# Altium schematic sheet [2]Battery.SchDoc
size B
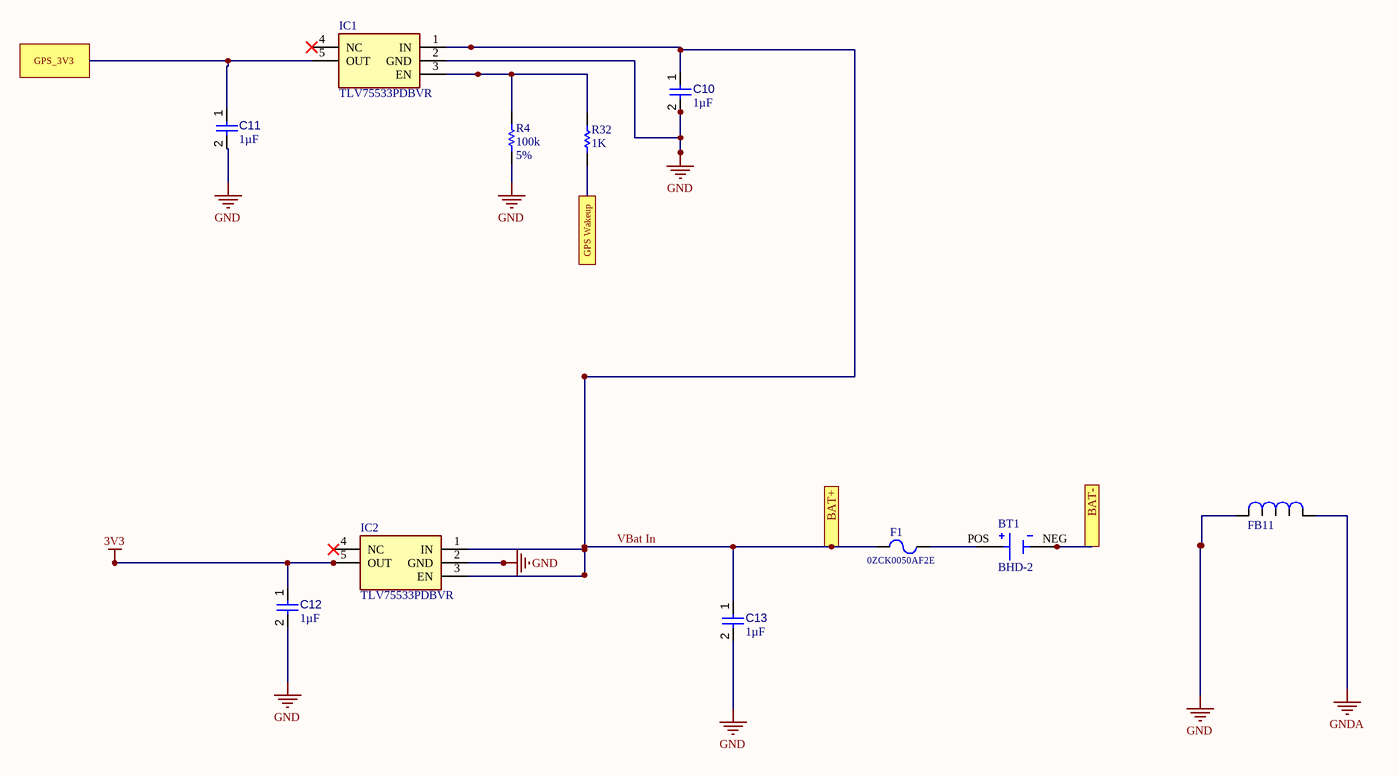
[diagram p0: [2]Battery.SchDoc]

## Parts
BT1  BHD-2  [BAT_BHD-2]
C10  value 1µF  [CAPC1608X90X40ML10T20]  (hidden comment: Capacitor 1 uF +/- 10% 25 V 0603)
C11  value 1µF  [CAPC1608X90X40ML10T20]  (hidden comment: Capacitor 1 uF +/- 10% 25 V 0603)
C12  value 1µF  [CAPC1608X90X40ML10T20]  (hidden comment: Capacitor 1 uF +/- 10% 25 V 0603)
C13  value 1µF  [CAPC1608X90X40ML10T20]  (hidden comment: Capacitor 1 uF +/- 10% 25 V 0603)
F1  MF PN: 0ZCK0050AF2E  [PTC RESET FUSE 9V 500MA 0805]  (hidden comment: PTC 9V 500mA)
FB11  BLM18AG102SN1D  [Ferrite Bead]  (value not drawn)
IC1  TLV75533PDBVR  [SOT95P280X145-5N]
IC2  TLV75533PDBVR  [SOT95P280X145-5N]
R4  value 100k  Tolerance: 5%  [RES 0603]  (hidden comment: RES 100K 5% 0.1W [0603])
R32  1K  [RES 0603]

## Ports
BAT+, BAT-, GPS Wakeup, GPS_3V3

## Nets
3V3: C12.1 IC2.5(OUT)
GND: C10.2 C11.2 C12.2 C13.2 FB11.2 IC1.2(GND) IC2.2(GND) R4.1
GNDA: FB11.1
BAT-: BT1.NEG ; port BAT-
GPS Wakeup: R32.2 ; port GPS Wakeup
GPS_3V3: C11.1 IC1.5(OUT) ; port GPS_3V3
VBat In: C10.1 C13.1 F1.1 IC1.1(IN) IC2.1(IN) IC2.3(EN) ; port BAT+
NetBT1_POS: BT1.POS F1.2
NetIC1_3: IC1.3(EN) R4.2 R32.1

Not connected (* = marked no-connect by the designer): IC1 4(NC)*; IC2 4(NC)*

## Notes on the sheet
- Title
- Size:
- Date:
- A3
- Number:
- Time:
- Revision:
- Sheet
- of
- File:

## Library data of the parts
BT1 = BHD-2: BATTERY HOLDER D PC PIN; MF: MPD; Value: *; Package: None; MP: BHD-2; Price: None; Availability: Bad; SnapEDA_Link: https://www.snapeda.com/parts/BHD-2/Memory%20Protection%20Devices/view-part/4219639/?ref=snap; BuyPart: https://www.snapeda.com/parts/BHD-2/Memory%20Protection%20Devices/view-part/4219639/?ref=eda
C10-C13 = CMP-001-00005-4: Chip Capacitor, 1 uF, +/- 10%, 25 V, 0603 (1608 Metric); Voltage Rating: 25V; Capacitor Type: Ceramic; Min Operating Temperature: -55°C; Tolerance: 10%; Max Operating Temperature: 125°C; Case/Package: 0603; RoHS Compliant: True; Mounting Technology: SM; Pins: 2
F1 = PTC RESET FUSE 9V 500MA 0805: DK PN: 507-2075-1-ND; Supplier 1: Digi-Key; Supplier Part Number 1: 507-2075-1-ND; Datasheet: https://www.belfuse.com/resources/datasheets/circuitprotection/ds-cp-0zck-series.pdf
FB11 = Ferrite Bead: Ferrite Bead 1KOhm @100MHz; Datasheet: https://www.murata.com/en-us/products/productdata/8796738650142/ENFA0003.pdf?src-supplier=Digi-Key; Supplier 1: Mouser; Supplier Part Number 1: 81-BLM11A102S; PN: BLM18AG102SN1D
IC1 IC2 = TLV75533PDBVR: Integrated Circuit; Manufacturer_Name: Texas Instruments; Datasheet Link: http://www.ti.com/lit/gpn/tlv755p; Height: 1.45mm; Manufacturer_Part_Number: TLV75533PDBVR; Mouser Part Number: 595-TLV75533PDBVR; Mouser Price/Stock: https://www.mouser.co.uk/ProductDetail/Texas-Instruments/TLV75533PDBVR?qs=55YtniHzbhAKEwqeO2xJXQ%3D%3D; Arrow Part Number: TLV75533PDBVR; Arrow Price/Stock: https://www.arrow.com/en/products/tlv75533pdbvr/texas-instruments
R4 = RES 3.3M 1% 0.1W [0603]: Supplier 1: Digi-Key; Supplier Part Number 1: 541-3.30MHCT-ND
R32 = RES 3.3M 1% 0.1W [0603]: 1K 1% 0.1W [0603]; Value: 1M; Supplier 1: Digi-Key; Supplier Part Number 1: 541-3.30MHCT-ND; Tolerance: 1%